# Altium schematic sheet 06_Servo_Motor_ICs.SchDoc: Servo Motor ICs
size A; Revision: A; SheetNumber: 6; SheetTotal: 10; ECE315_Project_Name: ECE453 F23 Base Project
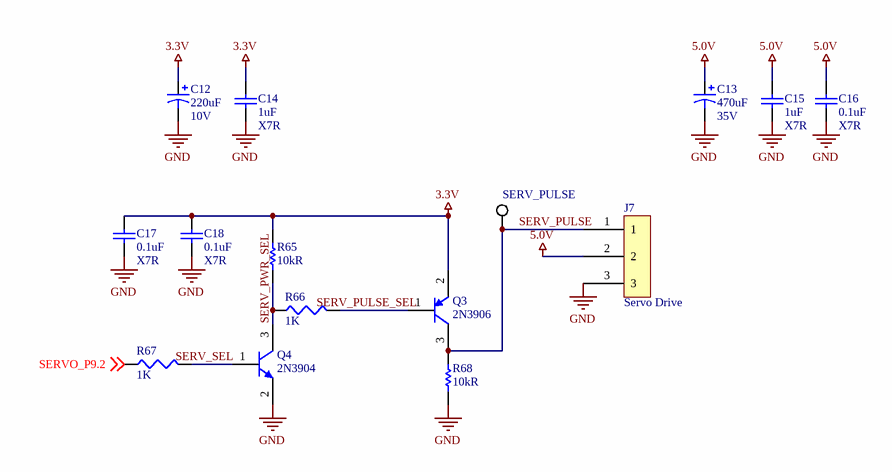
[diagram p0: 06_Servo_Motor_ICs.SchDoc]

## Parts
C12  Voltage: 10V  [CAPPR2-5x11]  (hidden comment: 220uF)
C13  Voltage: 35V  [CAPPR5-10x12.5]  (hidden comment: 470uF)
C14  Dielectric: X7R  [CAP_0805]  (hidden comment: 1uF)
C15  Dielectric: X7R  [CAP_0805]  (hidden comment: 1uF)
C16  Dielectric: X7R  [CAP_0805]  (hidden comment: 0.1uF)
C17  Dielectric: X7R  [CAP_0805]  (hidden comment: 0.1uF)
C18  Dielectric: X7R  [CAP_0805]  (hidden comment: 0.1uF)
J7  Servo Drive  [3X1HDR]
Q3  2N3906  [SOT23-3M]
Q4  2N3904  [SOT23-3M]
R65  Resistance: 10kR  [RESC2013X60X35NL10T20]  (hidden comment: RC0805FR-0710KL)
R66  value 1K  [RES_0805]  (hidden comment: 10K)
R67  value 1K  [RES_0805]  (hidden comment: 10K)
R68  Resistance: 10kR  [RESC2013X60X35NL10T20]  (hidden comment: RC0805FR-0710KL)
SERV_PULSE  (no value)  [KSTN-5019_V]

## Nets
3.3V: C12.1 C14.2 C17.1 C18.2 Q3.2(E) R65.2
5.0V: C13.1 C15.2 C16.2 J7.2
GND: C12.2 C13.2 C14.1 C15.1 C16.1 C17.2 C18.1 J7.3 Q4.2(E) R68.1
SERV_PULSE: J7.1 Q3.3(C) R68.2 SERV_PULSE.1
SERV_PULSE_SEL: Q3.1(B) R66.2
SERV_PWR_SEL: Q4.3(C) R65.1 R66.1
SERV_SEL: Q4.1(B) R67.2
SERVO_P9.2: R67.1 ; off-sheet SERVO_P9.2

## Notes on the sheet
- Title:
- Size:
- A
- Project
- Rev:
- Sheet:
- of
- College of Engineering
- 1415 Engineering Drive
- Madison, WI 53706

## Library data of the parts
C12 = Cap Pol1_1: Capacitor Al 105deg 220uF 10V 5X11; Manufacturer: Rubycon; Manufacturer Part Number: 10YXJ220M5X11; Tolerance: 20%; Ripple Current: 250mA; Impedance: 400mR; Leakage Current: 3uA; Life (Hours): 4000Hour; Lead Diameter: 0.5mm; Value: 220uF; Supplier: Digi-Key; Supplier Part Number: 1189-4150-ND; RoHS: Yes; Category: Aluminum Electrolytic Capacitors; Stock 1: 94; Pricing 1: 1=0.26000, 10=0.17500, 50=0.11680, 100=0.09930, 500=0.07010, 1000=0.06134, 2500=0.05842, 5000=0.05404 (USD); Mount: Through Hole; Case/Package: Radial; Min Operating Temperature: -40°C; Max Operating Temperature: 105°C; Capacitance: 220uF; Termination: Radial; Package Quantity: 3000; Packaging: Bulk; Voltage Rating: 10V; Series: YXJ; Construction: RADIAL; Diameter: 5mm; Height: 11mm; Lead Pitch: 2mm; Height - Seated (Max): 0.492inch; Radiation Hardening: No; RoHS Compliant: Yes; ComponentLink1URL: https://datasheet.ciiva.com/11777/0900766b810307a1-11777018.pdf?src-supplier=RSComponents; ComponentLink1Description: https://datasheet.ciiva.com/11777/0900766b810307a1-11777018.pdf?src-supplier=RSComponents; ComponentLink2URL: https://datasheet.ciiva.com/6318/e-yxj-6318863.pdf?src-supplier=Digi-Key; ComponentLink2Description: https://datasheet.ciiva.com/6318/e-yxj-6318863.pdf?src-supplier=Digi-Key; ComponentLink3URL: https://datasheet.ciiva.com/11690/e-yxj-11690699.pdf?src-supplier=Avnet; ComponentLink3Description: https://datasheet.ciiva.com/11690/e-yxj-11690699.pdf?src-supplier=Avnet
C13 = Cap Pol3_1: CAP ALUM 470UF 20% 35V RADIAL; Manufacturer: Rubycon; Manufacturer Part Number: 35ZL470MEFC10X20; Leakage Current: 3uA; Lead Diameter: 0.6mm; Dielectric Material: Aluminium; Life (Hours): 4000Hour; Ripple Current: 1.82A; Impedance: 23mR; Value: 470uF; Case/Package: Radial; Max Operating Temperature: 105°C; REACH SVHC: Unknown; Min Operating Temperature: -40°C; Supplier Part Number: 35ZL470MEFC10X20-ND; Packaging: Bulk; Lead Pitch: 5mm; Diameter: 10mm; Capacitance: 470uF; Lead Free: Lead Free; Radiation Hardening: No; Package Quantity: 1000; Height: 20mm; Voltage Rating: 35V; Mount: Through Hole; Supplier: Digi-Key; Height - Seated (Max): 0.866inch; Tolerance: 20%; Termination: Radial
C14 C15 = Cap_5: CAP CER 1UF 50V X7R 0805; Manufacturer: Samsung; Manufacturer Part Number: CL21B105KBFNNNE; Tolerance: 10%; Dielectric Material: Ceramic; Value: 1uF; Case Code (Metric): 2012; Min Operating Temperature: -55°C; Mount: Surface Mount; Width: 0.049inch; Voltage Rating (DC): 50V; Voltage Rating: 50V; Height: 1.25mm; Case Code (Imperial): 0805; Supplier: Digi-Key; Supplier Part Number: 1276-1029-6-ND; Capacitance: 1uF; Case/Package: 0805; Construction: Flat; Max Operating Temperature: 125°C; REACH SVHC: No SVHC; Voltage: 50V; Packaging: Tape and Reel; Depth: 1.25mm; Package Quantity: 1; Radiation Hardening: No; Series: CL; Length: 2mm; Thickness: 0.053inch; Termination: SMD/SMT; Number of Pins: 2; RoHS Compliant: Yes
C16-C18 = Cap_1: Cap Ceramic 0.1uF 50V X7R 20% SMD 0805 125°C Plastic T/R; Manufacturer: KEMET; Manufacturer Part Number: C0805C104M5RAC7210; Supplier: Digi-Key; Supplier Part Number: 399-C0805C104M5RAC7210CT-ND; RoHS: Yes; Category: Ceramic Capacitors; Stock 1: 29705; Pricing 1: 1=0.10000, 10=0.05900, 50=0.03220, 100=0.02620, 500=0.01874, 1000=0.01472, 2500=0.01338, 5000=0.01231 (USD); Mounting Technology: Surface Mount; Case/Package: 0805; Dielectric Material: Ceramic; Min Operating Temperature: -55°C; Max Operating Temperature: 125°C; Packaging: Tape and Reel; Tolerance: 20%; Voltage Rating (DC): 50V; Construction: Flat; Length: 2mm; Height: 0.9mm; Depth: 1.25mm; Radiation Hardening: No; RoHS Compliant: Yes; ComponentLink1URL: https://datasheet.ciiva.com/26923/getdatasheetpartid-738954-26923963.pdf?src-supplier=Verical; ComponentLink1Description: https://datasheet.ciiva.com/26923/getdatasheetpartid-738954-26923963.pdf?src-supplier=Verical; Value: 0.1uF
J7 = 3-Pin_1: Switch Slide N.O./N.C. SPDT Top Slide 0.2A 30VDC PC Pins Thru-Hole; Manufacturer: E-Switch; Manufacturer Part Number: EG1218; Voltage Rating (DC): 30V; Electrical Life: 10000Cycles; Switch Travel: 2.5mm; Switch Function: On-On; Actuator Type: Standard; Contact Current Rating: 200mA; Operating Force: 250gf; Illumination Type: Non-Illuminated; Number of Positions: 2; Insulation Resistance: 100R; Contact Resistance: 20mR; Actuator Length: 2mm; Supplier 1: Digi-Key; Supplier Part Number 1: EG1903-ND; RoHS: Yes; Category: Slide Switches; Stock 1: 46638; Pricing 1: 1=0.74, 25=0.6664, 100=0.5958, 500=0.5047, 2500=0.42434 (USD); Mounting Technology: Through Hole; Pins: 3; Contact Material: Copper Alloy,Copper,Silver; Contact Plating: Silver; Min Operating Temperature: -20°C; Max Operating Temperature: 70°C; Throw Configuration: SPDT; Termination: PC Pin; Packaging: Bulk; Orientation: Straight; Series: EG; Voltage Rating (AC): 30V; Voltage Rating: 30V; Lead Free: Lead Free; RoHS Compliant: Yes; Reach SVHC Compliant: No; ComponentLink1URL: https://datasheet.ciiva.com/1699/p040040c-1699451.pdf?src-supplier=Newark; ComponentLink1Description: https://datasheet.ciiva.com/1699/p040040c-1699451.pdf?src-supplier=Newark
Q3 = 2N3906: TRANS PNP 40V 0.2A SOT23; Manufacturer Part Number: MMBT3906LT1G; Manufacturer: ON Semiconductor; Current - Collector (Ic) (Max): 200mA; Vce Saturation (Max) @ Ib, Ic: 400mV @ 5mA, 50mA; DC Current Gain (hFE) (Min) @ Ic, Vce: 100 @ 10mA, 1V; Power - Max: 300mW; Frequency - Transition: 250MHz; Transistor Type: PNP; Category: Discrete Semiconductor Products; RoHS: RoHS Compliant; Supplier: Digi-Key; Supplier Part Number: MMBT3906LT1GOSCT-ND; Packaging: Cut Tape (CT); Voltage - Collector Emitter Breakdown (Max): 40V; Mounting Type: Surface Mount; Supplier Device Package: SOT-23-3 (TO-236); Package / Case: TO-236-3, SC-59, SOT-23-3; Value: 2N3906
Q4 = 2N3904: NPN General Purpose Amplifier; Manufacturer Part Number: MMBT3904-7-F; Manufacturer: Diodes Incorporated; Frequency - Transition: 300MHz; Power - Max: 300mW; DC Current Gain (hFE) (Min) @ Ic, Vce: 100 @ 10mA, 1V; Current - Collector Cutoff (Max): 50nA (ICBO); Vce Saturation (Max) @ Ib, Ic: 300mV @ 5mA, 50mA; Voltage - Collector Emitter Breakdown (Max): 40V; Current - Collector (Ic) (Max): 200mA; Supplier Device Package: SOT-23-3; Mounting Type: Surface Mount; Transistor Type: NPN; Packaging: Cut Tape (CT); RoHS: RoHS Compliant; Package / Case: TO-236-3, SC-59, SOT-23-3; Supplier Part Number: MMBT3904-FDICT-ND; Supplier: Digi-Key; Category: Discrete Semiconductor Products; Value: 2N3904
R65 R68 = CMP-1659-00013-4: Chip Resistor, 10 KOhm, +/- 1%, 0.125 W, -55 to 155 degC, 0805 (2012 Metric), RoHS, Tape and Reel; Manufacturer: Yageo; Voltage Rating: 150 V; Temperature Coefficient: 100ppm/°C; Power Rating: 125mW; Value: 10kR; Mount: Surface Mount; ComponentLink1Description: Manufacturer URL; ComponentLink2URL: http://www.yageo.com/documents/recent/PYu-RC_Group_51_RoHS_L_04.pdf; Pins: 2; Length: 2 mm; Min Operating Temperature: -55 degC; Height: 0.5 mm; Mounting Technology: Surface Mount; RoHSCompliant: true; REACH SVHC: No SVHC; ComponentLink1URL: http://www.yageo.com/; Max Operating Temperature: 155 degC; PackageReference: 0805; DatasheetVersion: Rev. 4, 02/2016; Package Quantity: 5000; Packaging: Tape and Reel; ComponentLink2Description: Datasheet; PackageDescription: 2-Pin Surface Mounted Device, Body 2 x 1.25 mm; Supplier 1: Digi-Key; Supplier Part Number 1: 311-10.0KCRCT-ND; Manufacturer 1: Yageo; Manufacturer Part Number 1: RC0805FR-0710KL; RoHS: Yes; Category: Chip SMD Resistors; Stock 1: 5682818; Pricing 1: 1=0.10000, 10=0.03800, 100=0.01560, 1000=0.00702, 2500=0.00610 (USD); Case/Package: 0805; Case Code (Imperial): 0805; Case Code (Metric): 2012; Size Code: 0805; Tolerance: 1%; Resistor Type: Thick Film; Series: RC; Number of Terminations: 2; Max Power Dissipation: 125mW; Termination: SMD/SMT; Features: Moisture Resistant; Construction: Rectangular; Resistance Tolerance: 1%; Technology: THICK FILM; Width: 0.049inch; Depth: 1.25mm; RoHS Compliant: Yes; Military Standard: Not; Lead Free: Lead Free; ComponentLink3URL: https://datasheet.ciiva.com/11808/0900766b8106beab-11808151.pdf?src-supplier=RSComponents; ComponentLink3Description: https://datasheet.ciiva.com/11808/0900766b8106beab-11808151.pdf?src-supplier=RSComponents; ComponentLink4URL: https://datasheet.ciiva.com/46447/444164-46447563.pdf?src-supplier=Element14; ComponentLink4Description: https://datasheet.ciiva.com/46447/444164-46447563.pdf?src-supplier=Element14; ComponentLink5URL: https://datasheet.ciiva.com/2456/pyu-r-int-thick-7-2456973.pdf?src-supplier=Digi-Key; ComponentLink5Description: https://datasheet.ciiva.com/2456/pyu-r-int-thick-7-2456973.pdf?src-supplier=Digi-Key; ComponentLink6URL: https://datasheet.ciiva.com/2456/pyu-r-int-thick-7-2456974.pdf?src-supplier=Digi-Key; ComponentLink6Description: https://datasheet.ciiva.com/2456/pyu-r-int-thick-7-2456974.pdf?src-supplier=Digi-Key; ComponentLink7URL: https://datasheet.ciiva.com/2456/pyu-r-int-thick-7-2456972.pdf?src-supplier=Digi-Key; ComponentLink7Description: https://datasheet.ciiva.com/2456/pyu-r-int-thick-7-2456972.pdf?src-supplier=Digi-Key; ComponentLink8URL: https://datasheet.ciiva.com/12669/rc0805-12669688.pdf?src-supplier=Mouser; ComponentLink8Description: https://datasheet.ciiva.com/12669/rc0805-12669688.pdf?src-supplier=Mouser; ComponentLink9URL: https://datasheet.ciiva.com/16747/rc0805-16747087.pdf?src-supplier=Future+Electronics; ComponentLink9Description: https://datasheet.ciiva.com/16747/rc0805-16747087.pdf?src-supplier=Future+Electronics; Supplier: Newark; Supplier Part Number: 05M4535; Manufacturer Part Number: RC0805FR-0710KL; Stock: 346650; Pricing: 1=0.102, 10=0.035, 25=0.028, 50=0.021, 100=0.014 (USD); Reach SVHC Compliant: Unknown; ComponentLink10URL: https://datasheet.ciiva.com/11808/0900766b8106beab-11808151.pdf?src-supplier=Rs; ComponentLink10Description: https://datasheet.ciiva.com/11808/0900766b8106beab-11808151.pdf?src-supplier=Rs
R66 R67 = Res3_1: Res Thick Film 0805 1K Ohm 1% 0.125W(1/8W) ±100ppm/C Pad SMD Automotive T/R; Manufacturer: Stackpole Electronics; Manufacturer Part Number: RMCF0805FT1K00; Power Rating: 125mW; Temperature Coefficient: 100ppm/°C; Supplier 1: Digi-Key; Supplier Part Number 1: RMCF0805FT1K00CT-ND; RoHS: Yes; Category: Chip SMD Resistors; Stock 1: 2773085; Pricing 1: 1=0.10000, 10=0.02400, 100=0.00970, 1000=0.00437, 2500=0.00379 (USD); Mounting Technology: Surface Mount; Case/Package: 0805; Case Code (Metric): 2012; Case Code (Imperial): 0805; Contact Plating: Tin,Matte; Min Operating Temperature: -55°C; Max Operating Temperature: 155°C; Tolerance: 1%; Packaging: Tape and Reel; Resistor Type: Thick Film; Number of Terminations: 2; Max Power Dissipation: 125mW; Features: Automotive AEC-Q200; Series: RMCF; Construction: Rectangular; Length: 2mm; Width: 0.049inch; Height: 0.026inch; Depth: 1.25mm; Radiation Hardening: No; Military Standard: Not; Lead Free: Lead Free; RoHS Compliant: Yes; ComponentLink1URL: https://datasheet.ciiva.com/15193/getdatasheetpartid-360136-15193546.pdf?src-supplier=Verical; ComponentLink1Description: https://datasheet.ciiva.com/15193/getdatasheetpartid-360136-15193546.pdf?src-supplier=Verical
SERV_PULSE = CMP-1672-00008-1: Test Point, 1 Position SMD, RoHS, Tape and Reel; Manufacturer: Keystone Electronics; Manufacturer Part Number: 5019; Plating: Silver; Body Material: Bronze; Supplier: Newark; Supplier Part Number: 59Y8500; RoHS: Yes; Category: Connectors; Stock: 11269; Pricing: 1=0.411, 10=0.389, 25=0.285, 50=0.279, 100=0.273, 250=0.246 (USD); Mounting Technology: Surface Mount,PCB; Pins: 1; Contact Plating: Silver; Contact Material: Bronze; Material: Bronze; Packaging: Tape and Reel; Package Quantity: 1; Termination: SMD/SMT; Series: 5019; Height: 0.09inch; Reach SVHC Compliant: No; RoHS Compliant: Yes; Lead Free: Lead Free; ComponentLink1URL: https://datasheet.ciiva.com/14848/m60-2p61-14848437.pdf?src-supplier=Digi-Key; ComponentLink1Description: https://datasheet.ciiva.com/14848/m60-2p61-14848437.pdf?src-supplier=Digi-Key; ComponentLink2URL: https://datasheet.ciiva.com/14848/m60-2p61-14848438.pdf?src-supplier=Digi-Key; ComponentLink2Description: https://datasheet.ciiva.com/14848/m60-2p61-14848438.pdf?src-supplier=Digi-Key; ComponentLink3URL: https://datasheet.ciiva.com/14848/m60-2p61-14848439.pdf?src-supplier=Digi-Key; ComponentLink3Description: https://datasheet.ciiva.com/14848/m60-2p61-14848439.pdf?src-supplier=Digi-Key; ComponentLink4URL: https://datasheet.ciiva.com/16318/m60-2p61-16318395.pdf?src-supplier=Future+Electronics; ComponentLink4Description: https://datasheet.ciiva.com/16318/m60-2p61-16318395.pdf?src-supplier=Future+Electronics; ComponentLink5URL: https://datasheet.ciiva.com/16885/70182998-16885945.pdf?src-supplier=Allied+Electronics; ComponentLink5Description: https://datasheet.ciiva.com/16885/70182998-16885945.pdf?src-supplier=Allied+Electronics